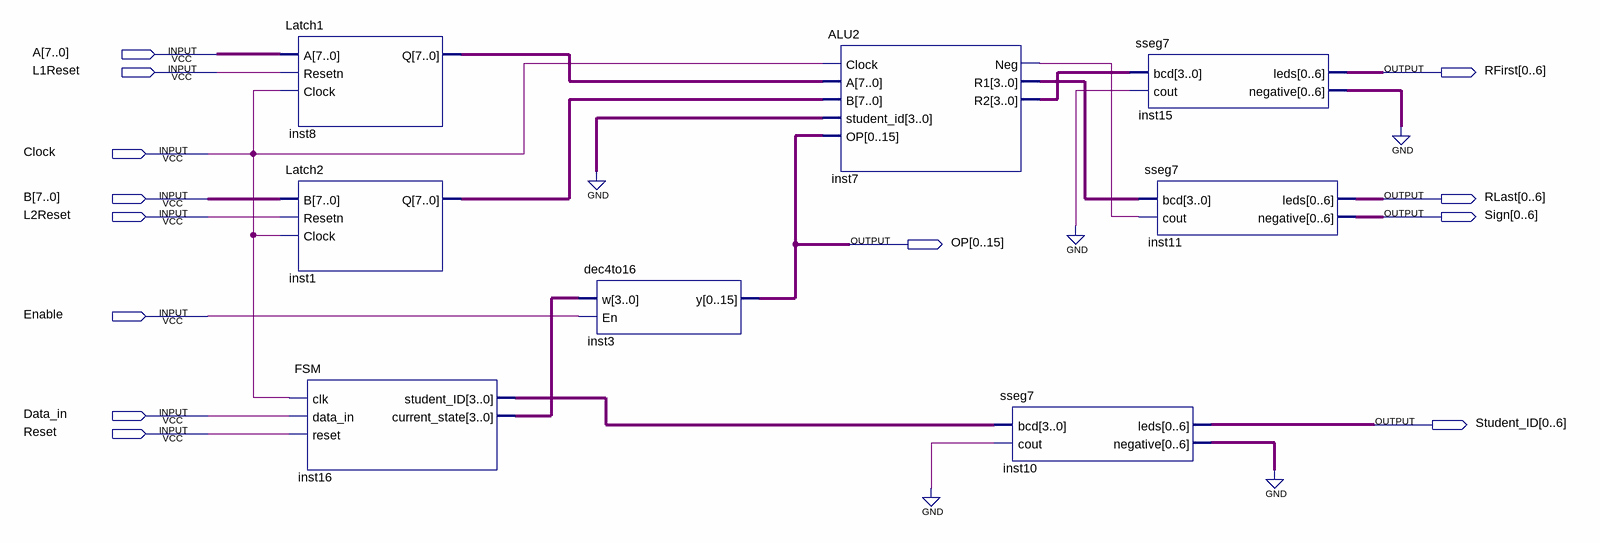
[diagram p0: schematic sheet]
// Quartus schematic ALU2_Block.bdf as structural Verilog: 8 symbols, 13 pins
module ALU2_Block (
  input  [7:0] A,
  input  L1Reset,
  input  Clock,
  input  [7:0] B,
  input  L2Reset,
  input  Enable,
  input  Data_in,
  input  Reset,
  output [0:6] RFirst,
  output [0:6] RLast,
  output [0:6] Sign,
  output [0:15] OP,
  output [0:6] Student_ID
);

  wire inst7_neg;
  wire [3:0] inst7_r1, inst7_r2, inst16_current_state, inst16_student_id;
  wire [6:0] inst10_negative, inst15_negative;
  wire [7:0] inst1_q, inst8_q;

  Latch1 inst8 (.A(A), .Resetn(L1Reset), .Clock(Clock), .Q(inst8_q));
  Latch2 inst1 (.B(B), .Resetn(L2Reset), .Clock(Clock), .Q(inst1_q));
  FSM inst16 (
    .clk(Clock), .data_in(Data_in), .reset(Reset), .student_ID(inst16_student_id),
    .current_state(inst16_current_state));
  dec4to16 inst3 (.w(inst16_current_state), .En(Enable), .y(OP));
  ALU2 inst7 (
    .Clock(Clock), .A(inst8_q), .B(inst1_q), .student_id(4'b0000), .OP(OP), .Neg(inst7_neg), .R1(inst7_r1),
    .R2(inst7_r2));
  sseg7 inst10 (.bcd(inst16_student_id), .cout(1'b0), .leds(Student_ID), .negative(inst10_negative));
  sseg7 inst15 (.bcd(inst7_r2), .cout(1'b0), .leds(RFirst), .negative(inst15_negative));
  sseg7 inst11 (.bcd(inst7_r1), .cout(inst7_neg), .leds(RLast), .negative(Sign));
  // also tied to GND on the sheet: {inst10_negative[0], inst10_negative[1], inst10_negative[2], inst10_negative[3], inst10_negative[4], inst10_negative[5], inst10_negative[6], inst15_negative[0], inst15_negative[1], inst15_negative[2], inst15_negative[3], inst15_negative[4], inst15_negative[5], inst15_negative[6]}
endmodule
